# EAGLE design relay-dpdt-motor (EAGLE 7.2.0)
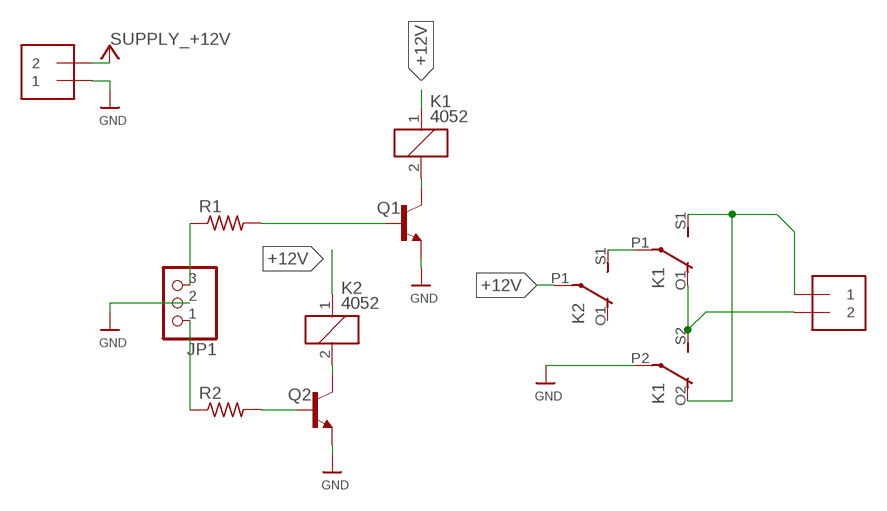
[diagram p0: schematic, sheet 1]

## Parts
J1  1X2-3.5MM  [1X2-3.5MM]
J2  1X2-3.5MM  [1X2-3.5MM]
JP1  PINHD-1X3CB  [1X03-CLEANBIG]
K1  4052  [F4052]
K2  4052  [F4052]
Q1  TRANSISTOR_BJT_NPN-TO-92-EBC  [TO-92]
Q2  TRANSISTOR_BJT_NPN-TO-92-EBC  [TO-92]
R1  R-US_0204/7  [0204/7]
R2  R-US_0204/7  [0204/7]

## Nets
+12V: J1.2 K1.1 K2.1 K2.P1(2:P) ; supply symbol labelled SUPPLY_+12V
GND: J1.1 JP1.2 K1.P2(3:P) Q1.1(E) Q2.1(E)
N$1: Q1.2(B) R1.2
N$2: K1.P1(2:P) K2.S1(2:S)
N$3: Q2.2(B) R2.2
N$4: K2.2 Q2.3(C)
N$5: JP1.1 R2.1
N$6: J2.1 K1.O2(3:O) K1.S1(2:S)
N$7: J2.2 K1.O1(2:O) K1.S2(3:S)
N$8: K1.2 Q1.3(C)
N$9: JP1.3 R1.1
Unconnected: K2.O1(2:O) K2.O2(3:O) K2.P2(3:P) K2.S2(3:S)

## Library data of the parts
J1 J2 = adafruit:1X2: 3.5mm Terminal block http://www.ladyada.net/library/pcb/eaglelibrary.html
JP1 = adafruit:PINHD-1X3: PIN HEADER
K1 K2 = relay:4052: RELAY 2 x switch, Finder; OC_FARNELL: unknown; OC_NEWARK: unknown
Q1 Q2 = dp_devices:TRANSISTOR_BJT_NPN: Most commonly used is SOT23-BEC
R1 R2 = adafruit:R-US_: RESISTOR, American symbol

## Board
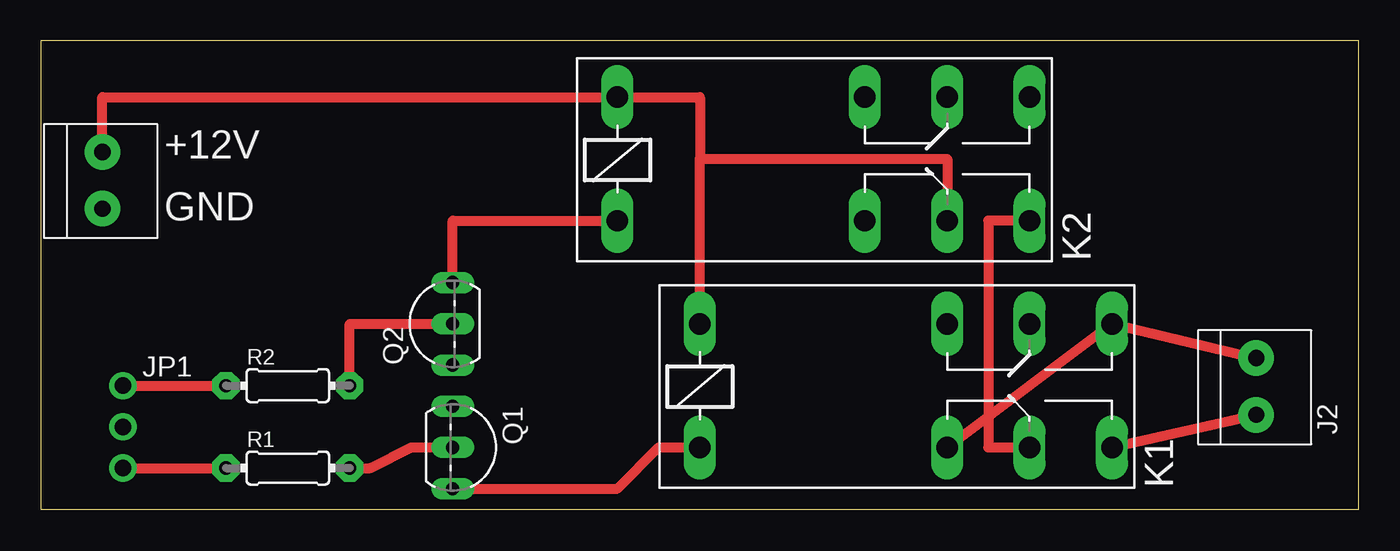
[diagram p1: board, top side]
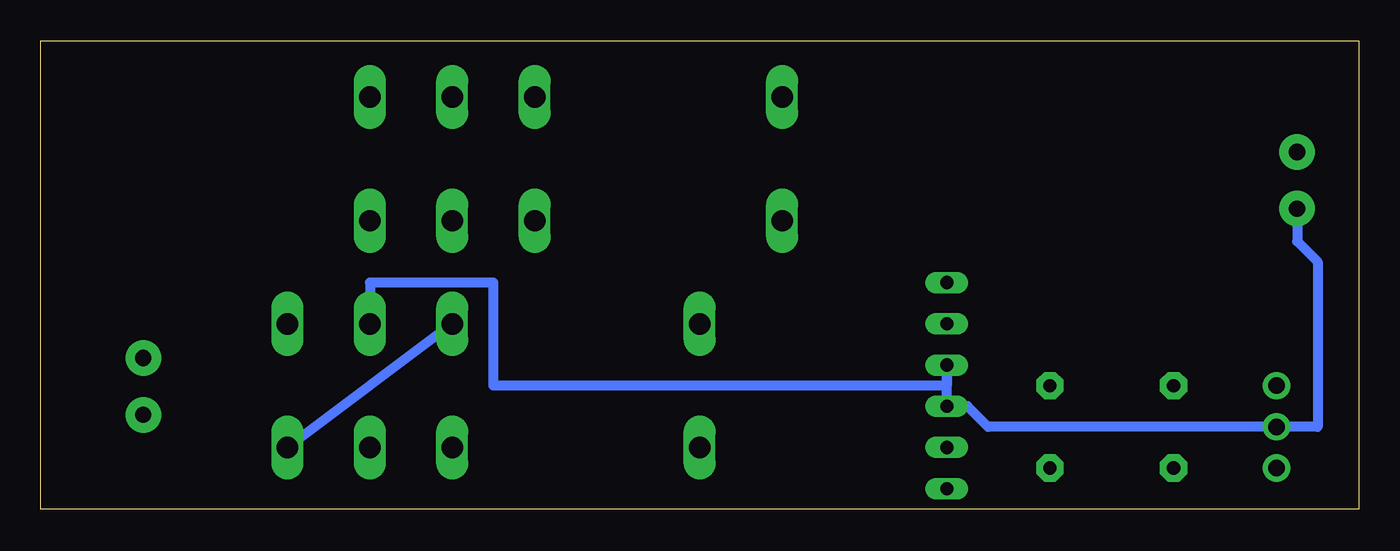
[diagram p2: board, bottom side, seen from below]

Size 81.26 x 28.88 mm. Coordinates in mm from the lower left corner, seen from the top.
Outline: 0,0 81.26,0 81.26,28.88 0,28.88 0,0
Copper layers (1*16): Top 0.035mm / dielectric 1.5mm / Bottom 0.035mm
Design rules "default": minimum track width 10mil, minimum drill 0.6mm, track to track 8mil, track to pad 8mil, pad to pad 8mil, via to via 8mil, smd to smd 8mil, copper to edge 40mil, drill to drill 8mil, minimum pad ring 10mil, minimum via ring 8mil, stop-mask expansion 4mil, vias tented up to drill 0mil, thermal gap 10mil

### Footprints (pad centres in the part's own frame; a part is rotated, then mirrored left to right if it is on the bottom)
1X2-3.5MM = drill 1 pad 2.184: 1 1.8,0; 2 -1.7,0
1X03-CLEANBIG = drill 1.016 pad 1.676: 1 -2.54,0; 2 0,0; 3 2.54,0
F4052 = drill 1.321 long: 1 -3.81,3.81; 2 -3.81,-3.81; O1 11.43,-3.81; O2 11.43,3.81; P1 16.51,-3.81; P2 16.51,3.81; S1 21.59,-3.81; S2 21.59,3.81
TO-92 = drill 0.813 long: 1 -2.54,0; 2 0,0; 3 2.54,0
0204/7 = drill 0.813 pad 1.676 octagon: 1 -3.81,0; 2 3.81,0

### Placement (x,y rotation side)
J1  3.81,20.32 270 top
J2  74.93,7.62 270 top
JP1  5.08,5.08 270 top
K1  44.45,7.62 0 top
K2  39.37,21.59 0 top
Q1  25.4,3.81 270 top
Q2  25.4,11.43 90 top
R1  15.24,2.54 0 top
R2  15.24,7.62 0 top

### Tracks (layer width: path | path; a pad name or v marks a point on that pad's centre or on a via)
+12V
  Top 0.61: J1.2 3.81,25.4 K2.1 40.64,25.4 40.64,21.59 | K1.1 40.64,21.59 | 40.64,21.59 55.88,21.59 K2.P1
GND
  Bottom 0.61: J1.1 3.81,16.51 2.54,15.24 2.54,5.08 JP1.2 22.86,5.08 24.13,6.35 Q1.1 Q2.1 25.4,7.62 53.34,7.62 53.34,13.97 60.96,13.97 K1.P2
N$1
  Top 0.61: R1.2 20.32,2.54 22.86,3.81 Q1.2
N$2
  Top 0.61: K2.S1 58.42,17.78 58.42,3.81 K1.P1
N$3
  Top 0.61: R2.2 19.05,11.43 Q2.2
N$4
  Top 0.61: Q2.3 25.4,17.78 K2.2
N$5
  Top 0.61: JP1.1 R2.1
N$6
  Top 0.61: K1.S1 J2.1
  Bottom 0.61: K1.O2 K1.S1
N$7
  Top 0.61: K1.O1 K1.S2 J2.2
N$8
  Top 0.61: Q1.3 35.56,1.27 38.1,3.81 K1.2
N$9
  Top 0.61: JP1.3 R1.1

### Text on the board
tPlace: +12V | GND